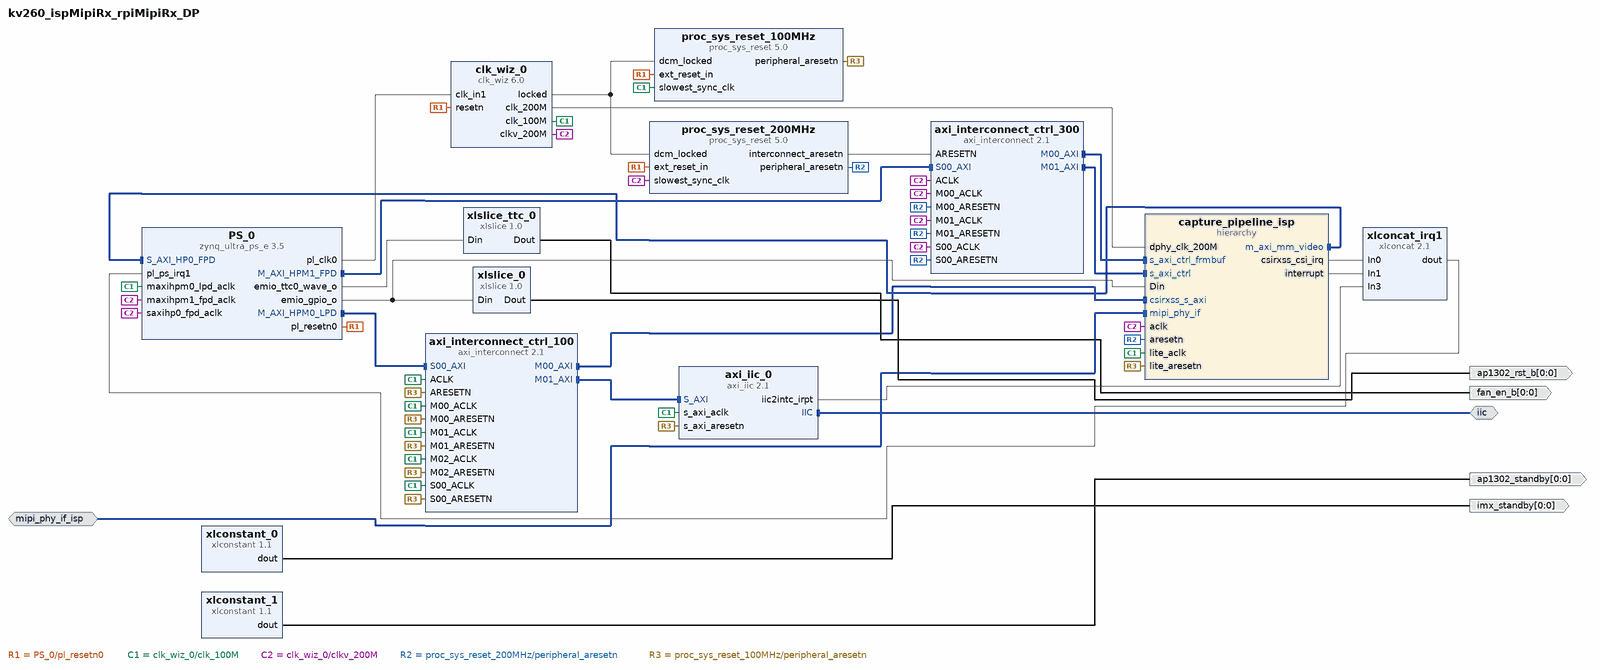
[diagram p0: block diagram of the top level]
# Vivado block design kv260_ispMipiRx_rpiMipiRx_DP, xck26-sfvc784-2LV-c, Vivado 2023.1
create_bd_design kv260_ispMipiRx_rpiMipiRx_DP

create_bd_intf_port -mode Master -vlnv xilinx.com:interface:iic_rtl:1.0 iic
create_bd_intf_port -mode Slave -vlnv xilinx.com:interface:mipi_phy_rtl:1.0 mipi_phy_if_isp
create_bd_port -dir O -from 0 -to 0 ap1302_rst_b
create_bd_port -dir O -from 0 -to 0 ap1302_standby
create_bd_port -dir O -from 0 -to 0 fan_en_b
create_bd_port -dir O -from 0 -to 0 imx_standby

create_bd_cell -type ip -vlnv xilinx.com:ip:zynq_ultra_ps_e:3.5 PS_0
set_property -dict [list \
  CONFIG.PSU_BANK_0_IO_STANDARD LVCMOS18 \
  CONFIG.PSU_BANK_1_IO_STANDARD LVCMOS18 \
  CONFIG.PSU_BANK_2_IO_STANDARD LVCMOS18 \
  CONFIG.PSU_BANK_3_IO_STANDARD LVCMOS18 \
  CONFIG.PSU_USB3__DUAL_CLOCK_ENABLE 1 \
  CONFIG.PSU__CAN1__PERIPHERAL__ENABLE 0 \
  CONFIG.PSU__CRF_APB__ACPU_CTRL__FREQMHZ 1333.333 \
  CONFIG.PSU__CRF_APB__ACPU_CTRL__SRCSEL APLL \
  CONFIG.PSU__CRF_APB__APLL_CTRL__SRCSEL PSS_REF_CLK \
  CONFIG.PSU__CRF_APB__APLL_FRAC_CFG__ENABLED 1 \
  CONFIG.PSU__CRF_APB__DBG_FPD_CTRL__FREQMHZ 250 \
  CONFIG.PSU__CRF_APB__DBG_FPD_CTRL__SRCSEL IOPLL \
  CONFIG.PSU__CRF_APB__DBG_TRACE_CTRL__FREQMHZ 250 \
  CONFIG.PSU__CRF_APB__DBG_TRACE_CTRL__SRCSEL IOPLL \
  CONFIG.PSU__CRF_APB__DBG_TSTMP_CTRL__FREQMHZ 250 \
  CONFIG.PSU__CRF_APB__DBG_TSTMP_CTRL__SRCSEL IOPLL \
  CONFIG.PSU__CRF_APB__DDR_CTRL__FREQMHZ 1200 \
  CONFIG.PSU__CRF_APB__DDR_CTRL__SRCSEL DPLL \
  CONFIG.PSU__CRF_APB__DPDMA_REF_CTRL__FREQMHZ 600 \
  CONFIG.PSU__CRF_APB__DPDMA_REF_CTRL__SRCSEL APLL \
  CONFIG.PSU__CRF_APB__DPLL_CTRL__SRCSEL PSS_REF_CLK \
  CONFIG.PSU__CRF_APB__DP_AUDIO_REF_CTRL__SRCSEL RPLL \
  CONFIG.PSU__CRF_APB__DP_STC_REF_CTRL__SRCSEL RPLL \
  CONFIG.PSU__CRF_APB__DP_VIDEO_REF_CTRL__SRCSEL VPLL \
  CONFIG.PSU__CRF_APB__GDMA_REF_CTRL__FREQMHZ 600 \
  CONFIG.PSU__CRF_APB__GDMA_REF_CTRL__SRCSEL DPLL \
  CONFIG.PSU__CRF_APB__GPU_REF_CTRL__FREQMHZ 600 \
  CONFIG.PSU__CRF_APB__GPU_REF_CTRL__SRCSEL IOPLL \
  CONFIG.PSU__CRF_APB__TOPSW_LSBUS_CTRL__FREQMHZ 100 \
  CONFIG.PSU__CRF_APB__TOPSW_LSBUS_CTRL__SRCSEL IOPLL \
  CONFIG.PSU__CRF_APB__TOPSW_MAIN_CTRL__FREQMHZ 533.33 \
  CONFIG.PSU__CRF_APB__TOPSW_MAIN_CTRL__SRCSEL DPLL \
  CONFIG.PSU__CRF_APB__VPLL_CTRL__SRCSEL PSS_REF_CLK \
  CONFIG.PSU__CRL_APB__ADMA_REF_CTRL__FREQMHZ 500 \
  CONFIG.PSU__CRL_APB__ADMA_REF_CTRL__SRCSEL IOPLL \
  CONFIG.PSU__CRL_APB__CAN1_REF_CTRL__FREQMHZ 100 \
  CONFIG.PSU__CRL_APB__CAN1_REF_CTRL__SRCSEL IOPLL \
  CONFIG.PSU__CRL_APB__CPU_R5_CTRL__FREQMHZ 533.333 \
  CONFIG.PSU__CRL_APB__CPU_R5_CTRL__SRCSEL RPLL \
  CONFIG.PSU__CRL_APB__CSU_PLL_CTRL__FREQMHZ 400 \
  CONFIG.PSU__CRL_APB__CSU_PLL_CTRL__SRCSEL IOPLL \
  CONFIG.PSU__CRL_APB__DBG_LPD_CTRL__FREQMHZ 250 \
  CONFIG.PSU__CRL_APB__DBG_LPD_CTRL__SRCSEL IOPLL \
  CONFIG.PSU__CRL_APB__GEM3_REF_CTRL__FREQMHZ 125 \
  CONFIG.PSU__CRL_APB__GEM3_REF_CTRL__SRCSEL IOPLL \
  CONFIG.PSU__CRL_APB__I2C0_REF_CTRL__FREQMHZ 100 \
  CONFIG.PSU__CRL_APB__I2C0_REF_CTRL__SRCSEL IOPLL \
  CONFIG.PSU__CRL_APB__I2C1_REF_CTRL__FREQMHZ 100 \
  CONFIG.PSU__CRL_APB__I2C1_REF_CTRL__SRCSEL IOPLL \
  CONFIG.PSU__CRL_APB__IOPLL_CTRL__SRCSEL PSS_REF_CLK \
  CONFIG.PSU__CRL_APB__IOU_SWITCH_CTRL__FREQMHZ 250 \
  CONFIG.PSU__CRL_APB__IOU_SWITCH_CTRL__SRCSEL IOPLL \
  CONFIG.PSU__CRL_APB__LPD_LSBUS_CTRL__FREQMHZ 100 \
  CONFIG.PSU__CRL_APB__LPD_LSBUS_CTRL__SRCSEL IOPLL \
  CONFIG.PSU__CRL_APB__LPD_SWITCH_CTRL__FREQMHZ 500 \
  CONFIG.PSU__CRL_APB__LPD_SWITCH_CTRL__SRCSEL IOPLL \
  CONFIG.PSU__CRL_APB__PCAP_CTRL__FREQMHZ 200 \
  CONFIG.PSU__CRL_APB__PCAP_CTRL__SRCSEL IOPLL \
  CONFIG.PSU__CRL_APB__PL0_REF_CTRL__FREQMHZ 100 \
  CONFIG.PSU__CRL_APB__PL0_REF_CTRL__SRCSEL IOPLL \
  CONFIG.PSU__CRL_APB__QSPI_REF_CTRL__FREQMHZ 125 \
  CONFIG.PSU__CRL_APB__QSPI_REF_CTRL__SRCSEL IOPLL \
  CONFIG.PSU__CRL_APB__RPLL_CTRL__SRCSEL PSS_REF_CLK \
  CONFIG.PSU__CRL_APB__SDIO0_REF_CTRL__SRCSEL IOPLL \
  CONFIG.PSU__CRL_APB__SDIO1_REF_CTRL__FREQMHZ 200 \
  CONFIG.PSU__CRL_APB__SDIO1_REF_CTRL__SRCSEL IOPLL \
  CONFIG.PSU__CRL_APB__SPI0_REF_CTRL__SRCSEL IOPLL \
  CONFIG.PSU__CRL_APB__SPI1_REF_CTRL__SRCSEL IOPLL \
  CONFIG.PSU__CRL_APB__TIMESTAMP_REF_CTRL__FREQMHZ 100 \
  CONFIG.PSU__CRL_APB__TIMESTAMP_REF_CTRL__SRCSEL IOPLL \
  CONFIG.PSU__CRL_APB__UART0_REF_CTRL__FREQMHZ 100 \
  CONFIG.PSU__CRL_APB__UART0_REF_CTRL__SRCSEL IOPLL \
  CONFIG.PSU__CRL_APB__UART1_REF_CTRL__FREQMHZ 100 \
  CONFIG.PSU__CRL_APB__UART1_REF_CTRL__SRCSEL IOPLL \
  CONFIG.PSU__CRL_APB__USB0_BUS_REF_CTRL__FREQMHZ 250 \
  CONFIG.PSU__CRL_APB__USB0_BUS_REF_CTRL__SRCSEL IOPLL \
  CONFIG.PSU__CRL_APB__USB3_DUAL_REF_CTRL__FREQMHZ 20 \
  CONFIG.PSU__CRL_APB__USB3_DUAL_REF_CTRL__SRCSEL IOPLL \
  CONFIG.PSU__CRL_APB__USB3__ENABLE 1 \
  CONFIG.PSU__CSUPMU__PERIPHERAL__VALID 1 \
  CONFIG.PSU__DDRC__BUS_WIDTH {64 Bit} \
  CONFIG.PSU__DDRC__COMPONENTS Components \
  CONFIG.PSU__DDRC__DEVICE_CAPACITY {8192 MBits} \
  CONFIG.PSU__DDRC__DRAM_WIDTH {16 Bits} \
  CONFIG.PSU__DDRC__ECC Disabled \
  CONFIG.PSU__DDRC__FREQ_MHZ 1066.50 \
  CONFIG.PSU__DDRC__MEMORY_TYPE {DDR 4} \
  CONFIG.PSU__DDRC__SPEED_BIN DDR4_2400R \
  CONFIG.PSU__DDR_HIGH_ADDRESS_GUI_ENABLE 1 \
  CONFIG.PSU__DDR__INTERFACE__FREQMHZ 600.000 \
  CONFIG.PSU__DISPLAYPORT__LANE0__ENABLE 1 \
  CONFIG.PSU__DISPLAYPORT__LANE0__IO {GT Lane1} \
  CONFIG.PSU__DISPLAYPORT__LANE1__ENABLE 1 \
  CONFIG.PSU__DISPLAYPORT__LANE1__IO {GT Lane0} \
  CONFIG.PSU__DISPLAYPORT__PERIPHERAL__ENABLE 1 \
  CONFIG.PSU__DLL__ISUSED 1 \
  CONFIG.PSU__DPAUX__PERIPHERAL__ENABLE 1 \
  CONFIG.PSU__DPAUX__PERIPHERAL__IO {MIO 27 .. 30} \
  CONFIG.PSU__DP__LANE_SEL {Dual Lower} \
  CONFIG.PSU__DP__REF_CLK_FREQ 27 \
  CONFIG.PSU__DP__REF_CLK_SEL {Ref Clk0} \
  CONFIG.PSU__ENET3__FIFO__ENABLE 0 \
  CONFIG.PSU__ENET3__GRP_MDIO__ENABLE 1 \
  CONFIG.PSU__ENET3__GRP_MDIO__IO {MIO 76 .. 77} \
  CONFIG.PSU__ENET3__PERIPHERAL__ENABLE 1 \
  CONFIG.PSU__ENET3__PERIPHERAL__IO {MIO 64 .. 75} \
  CONFIG.PSU__ENET3__PTP__ENABLE 0 \
  CONFIG.PSU__ENET3__TSU__ENABLE 0 \
  CONFIG.PSU__FPGA_PL0_ENABLE 1 \
  CONFIG.PSU__GEM3_COHERENCY 0 \
  CONFIG.PSU__GEM3_ROUTE_THROUGH_FPD 0 \
  CONFIG.PSU__GEM__TSU__ENABLE 0 \
  CONFIG.PSU__GPIO0_MIO__IO {MIO 0 .. 25} \
  CONFIG.PSU__GPIO0_MIO__PERIPHERAL__ENABLE 1 \
  CONFIG.PSU__GPIO1_MIO__IO {MIO 26 .. 51} \
  CONFIG.PSU__GPIO1_MIO__PERIPHERAL__ENABLE 1 \
  CONFIG.PSU__GPIO_EMIO_WIDTH 95 \
  CONFIG.PSU__GPIO_EMIO__PERIPHERAL__ENABLE 1 \
  CONFIG.PSU__GPIO_EMIO__PERIPHERAL__IO 95 \
  CONFIG.PSU__GT__LINK_SPEED HBR \
  CONFIG.PSU__GT__PRE_EMPH_LVL_4 0 \
  CONFIG.PSU__GT__VLT_SWNG_LVL_4 0 \
  CONFIG.PSU__I2C0__PERIPHERAL__ENABLE 0 \
  CONFIG.PSU__I2C1__PERIPHERAL__ENABLE 1 \
  CONFIG.PSU__I2C1__PERIPHERAL__IO {MIO 24 .. 25} \
  CONFIG.PSU__IOU_SLCR__IOU_TTC_APB_CLK__TTC0_SEL APB \
  CONFIG.PSU__IOU_SLCR__IOU_TTC_APB_CLK__TTC1_SEL APB \
  CONFIG.PSU__IOU_SLCR__IOU_TTC_APB_CLK__TTC2_SEL APB \
  CONFIG.PSU__IOU_SLCR__IOU_TTC_APB_CLK__TTC3_SEL APB \
  CONFIG.PSU__MAXIGP1__DATA_WIDTH 32 \
  CONFIG.PSU__OVERRIDE__BASIC_CLOCK 0 \
  CONFIG.PSU__PMU_COHERENCY 0 \
  CONFIG.PSU__PMU__AIBACK__ENABLE 0 \
  CONFIG.PSU__PMU__EMIO_GPI__ENABLE 0 \
  CONFIG.PSU__PMU__EMIO_GPO__ENABLE 0 \
  CONFIG.PSU__PMU__GPI0__ENABLE 1 \
  CONFIG.PSU__PMU__GPI0__IO {MIO 26} \
  CONFIG.PSU__PMU__GPI1__ENABLE 0 \
  CONFIG.PSU__PMU__GPI2__ENABLE 0 \
  CONFIG.PSU__PMU__GPI3__ENABLE 0 \
  CONFIG.PSU__PMU__GPI4__ENABLE 0 \
  CONFIG.PSU__PMU__GPI5__ENABLE 1 \
  CONFIG.PSU__PMU__GPI5__IO {MIO 31} \
  CONFIG.PSU__PMU__GPO0__ENABLE 1 \
  CONFIG.PSU__PMU__GPO0__IO {MIO 32} \
  CONFIG.PSU__PMU__GPO1__ENABLE 1 \
  CONFIG.PSU__PMU__GPO1__IO {MIO 33} \
  CONFIG.PSU__PMU__GPO2__ENABLE 1 \
  CONFIG.PSU__PMU__GPO2__IO {MIO 34} \
  CONFIG.PSU__PMU__GPO2__POLARITY high \
  CONFIG.PSU__PMU__GPO3__ENABLE 1 \
  CONFIG.PSU__PMU__GPO3__IO {MIO 35} \
  CONFIG.PSU__PMU__GPO3__POLARITY low \
  CONFIG.PSU__PMU__GPO4__ENABLE 0 \
  CONFIG.PSU__PMU__GPO5__ENABLE 0 \
  CONFIG.PSU__PMU__PERIPHERAL__ENABLE 1 \
  CONFIG.PSU__PMU__PLERROR__ENABLE 0 \
  CONFIG.PSU__PRESET_APPLIED 1 \
  CONFIG.PSU__PSS_REF_CLK__FREQMHZ 33.333 \
  CONFIG.PSU__QSPI_COHERENCY 0 \
  CONFIG.PSU__QSPI_ROUTE_THROUGH_FPD 0 \
  CONFIG.PSU__QSPI__GRP_FBCLK__ENABLE 0 \
  CONFIG.PSU__QSPI__PERIPHERAL__DATA_MODE x4 \
  CONFIG.PSU__QSPI__PERIPHERAL__ENABLE 1 \
  CONFIG.PSU__QSPI__PERIPHERAL__IO {MIO 0 .. 5} \
  CONFIG.PSU__QSPI__PERIPHERAL__MODE Single \
  CONFIG.PSU__SATA__LANE1__IO {GT Lane3} \
  CONFIG.PSU__SATA__PERIPHERAL__ENABLE 1 \
  CONFIG.PSU__SATA__REF_CLK_FREQ 125 \
  CONFIG.PSU__SATA__REF_CLK_SEL {Ref Clk2} \
  CONFIG.PSU__SAXIGP2__DATA_WIDTH 64 \
  CONFIG.PSU__SD0__CLK_200_SDR_OTAP_DLY 0x3 \
  CONFIG.PSU__SD0__CLK_50_DDR_ITAP_DLY 0x12 \
  CONFIG.PSU__SD0__CLK_50_DDR_OTAP_DLY 0x6 \
  CONFIG.PSU__SD0__CLK_50_SDR_ITAP_DLY 0x15 \
  CONFIG.PSU__SD0__CLK_50_SDR_OTAP_DLY 0x6 \
  CONFIG.PSU__SD0__DATA_TRANSFER_MODE 8Bit \
  CONFIG.PSU__SD0__GRP_POW__ENABLE 1 \
  CONFIG.PSU__SD0__GRP_POW__IO {MIO 23} \
  CONFIG.PSU__SD0__PERIPHERAL__ENABLE 1 \
  CONFIG.PSU__SD0__PERIPHERAL__IO {MIO 13 .. 22} \
  CONFIG.PSU__SD0__RESET__ENABLE 1 \
  CONFIG.PSU__SD0__SLOT_TYPE eMMC \
  CONFIG.PSU__SD1_COHERENCY 0 \
  CONFIG.PSU__SD1_ROUTE_THROUGH_FPD 0 \
  CONFIG.PSU__SD1__CLK_100_SDR_OTAP_DLY 0x3 \
  CONFIG.PSU__SD1__CLK_200_SDR_OTAP_DLY 0x3 \
  CONFIG.PSU__SD1__CLK_50_DDR_ITAP_DLY 0x3D \
  CONFIG.PSU__SD1__CLK_50_DDR_OTAP_DLY 0x4 \
  CONFIG.PSU__SD1__CLK_50_SDR_ITAP_DLY 0x15 \
  CONFIG.PSU__SD1__CLK_50_SDR_OTAP_DLY 0x5 \
  CONFIG.PSU__SD1__DATA_TRANSFER_MODE 8Bit \
  CONFIG.PSU__SD1__GRP_CD__ENABLE 1 \
  CONFIG.PSU__SD1__GRP_CD__IO {MIO 45} \
  CONFIG.PSU__SD1__GRP_POW__ENABLE 1 \
  CONFIG.PSU__SD1__GRP_POW__IO {MIO 43} \
  CONFIG.PSU__SD1__GRP_WP__ENABLE 0 \
  CONFIG.PSU__SD1__PERIPHERAL__ENABLE 1 \
  CONFIG.PSU__SD1__PERIPHERAL__IO {MIO 39 .. 51} \
  CONFIG.PSU__SD1__SLOT_TYPE {SD 3.0} \
  CONFIG.PSU__SPI1__GRP_SS0__IO {MIO 9} \
  CONFIG.PSU__SPI1__PERIPHERAL__ENABLE 1 \
  CONFIG.PSU__SPI1__PERIPHERAL__IO {MIO 6 .. 11} \
  CONFIG.PSU__SWDT0__CLOCK__ENABLE 0 \
  CONFIG.PSU__SWDT0__PERIPHERAL__ENABLE 1 \
  CONFIG.PSU__SWDT0__RESET__ENABLE 0 \
  CONFIG.PSU__SWDT1__CLOCK__ENABLE 0 \
  CONFIG.PSU__SWDT1__PERIPHERAL__ENABLE 1 \
  CONFIG.PSU__SWDT1__RESET__ENABLE 0 \
  CONFIG.PSU__TSU__BUFG_PORT_PAIR 0 \
  CONFIG.PSU__TTC0__CLOCK__ENABLE 0 \
  CONFIG.PSU__TTC0__PERIPHERAL__ENABLE 1 \
  CONFIG.PSU__TTC0__WAVEOUT__ENABLE 1 \
  CONFIG.PSU__TTC0__WAVEOUT__IO EMIO \
  CONFIG.PSU__TTC1__CLOCK__ENABLE 0 \
  CONFIG.PSU__TTC1__PERIPHERAL__ENABLE 1 \
  CONFIG.PSU__TTC1__WAVEOUT__ENABLE 0 \
  CONFIG.PSU__TTC2__CLOCK__ENABLE 0 \
  CONFIG.PSU__TTC2__PERIPHERAL__ENABLE 1 \
  CONFIG.PSU__TTC2__WAVEOUT__ENABLE 0 \
  CONFIG.PSU__TTC3__CLOCK__ENABLE 0 \
  CONFIG.PSU__TTC3__PERIPHERAL__ENABLE 1 \
  CONFIG.PSU__TTC3__WAVEOUT__ENABLE 0 \
  CONFIG.PSU__UART1__BAUD_RATE 115200 \
  CONFIG.PSU__UART1__MODEM__ENABLE 0 \
  CONFIG.PSU__UART1__PERIPHERAL__ENABLE 1 \
  CONFIG.PSU__UART1__PERIPHERAL__IO {MIO 36 .. 37} \
  CONFIG.PSU__USB0_COHERENCY 0 \
  CONFIG.PSU__USB0__PERIPHERAL__ENABLE 1 \
  CONFIG.PSU__USB0__PERIPHERAL__IO {MIO 52 .. 63} \
  CONFIG.PSU__USB0__REF_CLK_FREQ 26 \
  CONFIG.PSU__USB0__REF_CLK_SEL {Ref Clk1} \
  CONFIG.PSU__USB2_0__EMIO__ENABLE 0 \
  CONFIG.PSU__USB3_0__EMIO__ENABLE 0 \
  CONFIG.PSU__USB3_0__PERIPHERAL__ENABLE 1 \
  CONFIG.PSU__USB3_0__PERIPHERAL__IO {GT Lane2} \
  CONFIG.PSU__USB__RESET__MODE {Boot Pin} \
  CONFIG.PSU__USB__RESET__POLARITY {Active Low} \
  CONFIG.PSU__USE__IRQ0 1 \
  CONFIG.PSU__USE__IRQ1 1 \
  CONFIG.PSU__USE__M_AXI_GP0 0 \
  CONFIG.PSU__USE__M_AXI_GP1 1 \
  CONFIG.PSU__USE__M_AXI_GP2 1 \
  CONFIG.PSU__USE__S_AXI_GP2 1 \
  CONFIG.SUBPRESET1 Custom \
] [get_bd_cells PS_0]
# 258 more settings of PS_0 are not shown: defaults, MIO pin electricals, DDR timing, and values the tool derives
create_bd_cell -type ip -vlnv xilinx.com:ip:axi_iic:2.1 axi_iic_0
set_property -dict {CONFIG.IIC_BOARD_INTERFACE som240_1_connector_hda_iic_switch CONFIG.IIC_FREQ_KHZ 400} [get_bd_cells axi_iic_0]
create_bd_cell -type ip -vlnv xilinx.com:ip:axi_interconnect:2.1 axi_interconnect_ctrl_100
set_property -dict {CONFIG.ENABLE_ADVANCED_OPTIONS 1 CONFIG.NUM_MI 3} [get_bd_cells axi_interconnect_ctrl_100]
create_bd_cell -type ip -vlnv xilinx.com:ip:axi_interconnect:2.1 axi_interconnect_ctrl_300
set_property -dict {CONFIG.NUM_MI 2 CONFIG.NUM_SI 1} [get_bd_cells axi_interconnect_ctrl_300]
create_bd_cell -type hier capture_pipeline_isp
create_bd_cell -type ip -vlnv xilinx.com:ip:clk_wiz:6.0 clk_wiz_0
set_property -dict [list \
  CONFIG.CLKOUT1_JITTER 102.087 \
  CONFIG.CLKOUT1_PHASE_ERROR 87.181 \
  CONFIG.CLKOUT1_REQUESTED_OUT_FREQ 200.000 \
  CONFIG.CLKOUT2_JITTER 115.833 \
  CONFIG.CLKOUT2_PHASE_ERROR 87.181 \
  CONFIG.CLKOUT2_USED true \
  CONFIG.CLKOUT3_JITTER 102.087 \
  CONFIG.CLKOUT3_PHASE_ERROR 87.181 \
  CONFIG.CLKOUT3_REQUESTED_OUT_FREQ 200.000 \
  CONFIG.CLKOUT3_USED true \
  CONFIG.CLKOUT4_JITTER 83.769 \
  CONFIG.CLKOUT4_PHASE_ERROR 87.181 \
  CONFIG.CLKOUT4_REQUESTED_OUT_FREQ 600.000 \
  CONFIG.CLKOUT4_USED false \
  CONFIG.CLKOUT5_JITTER 94.863 \
  CONFIG.CLKOUT5_PHASE_ERROR 87.181 \
  CONFIG.CLKOUT5_REQUESTED_OUT_FREQ 300.000 \
  CONFIG.CLKOUT5_USED false \
  CONFIG.CLK_OUT1_PORT clk_200M \
  CONFIG.CLK_OUT2_PORT clk_100M \
  CONFIG.CLK_OUT3_PORT clkv_200M \
  CONFIG.CLK_OUT4_PORT clk_600M \
  CONFIG.CLK_OUT5_PORT clk_300M \
  CONFIG.MMCM_CLKOUT0_DIVIDE_F 6.000 \
  CONFIG.MMCM_CLKOUT1_DIVIDE 12 \
  CONFIG.MMCM_CLKOUT2_DIVIDE 6 \
  CONFIG.MMCM_CLKOUT3_DIVIDE 1 \
  CONFIG.MMCM_CLKOUT4_DIVIDE 1 \
  CONFIG.MMCM_DIVCLK_DIVIDE 1 \
  CONFIG.NUM_OUT_CLKS 3 \
  CONFIG.PRIM_SOURCE Global_buffer \
  CONFIG.RESET_PORT resetn \
  CONFIG.RESET_TYPE ACTIVE_LOW \
] [get_bd_cells clk_wiz_0]
create_bd_cell -type ip -vlnv xilinx.com:ip:proc_sys_reset:5.0 proc_sys_reset_100MHz
create_bd_cell -type ip -vlnv xilinx.com:ip:proc_sys_reset:5.0 proc_sys_reset_200MHz
create_bd_cell -type ip -vlnv xilinx.com:ip:xlconcat:2.1 xlconcat_irq1
set_property -dict {CONFIG.NUM_PORTS 4} [get_bd_cells xlconcat_irq1]
create_bd_cell -type ip -vlnv xilinx.com:ip:xlconstant:1.1 xlconstant_0
create_bd_cell -type ip -vlnv xilinx.com:ip:xlconstant:1.1 xlconstant_1
set_property -dict {CONFIG.CONST_VAL 0} [get_bd_cells xlconstant_1]
create_bd_cell -type ip -vlnv xilinx.com:ip:xlslice:1.0 xlslice_0
set_property -dict {CONFIG.DIN_FROM 1 CONFIG.DIN_TO 1 CONFIG.DIN_WIDTH 95 CONFIG.DOUT_WIDTH 1} [get_bd_cells xlslice_0]
create_bd_cell -type ip -vlnv xilinx.com:ip:xlslice:1.0 xlslice_ttc_0
set_property -dict {CONFIG.DIN_FROM 2 CONFIG.DIN_TO 2 CONFIG.DIN_WIDTH 3 CONFIG.DOUT_WIDTH 1} [get_bd_cells xlslice_ttc_0]

# ---- hierarchy /capture_pipeline_isp ----
current_bd_instance /capture_pipeline_isp
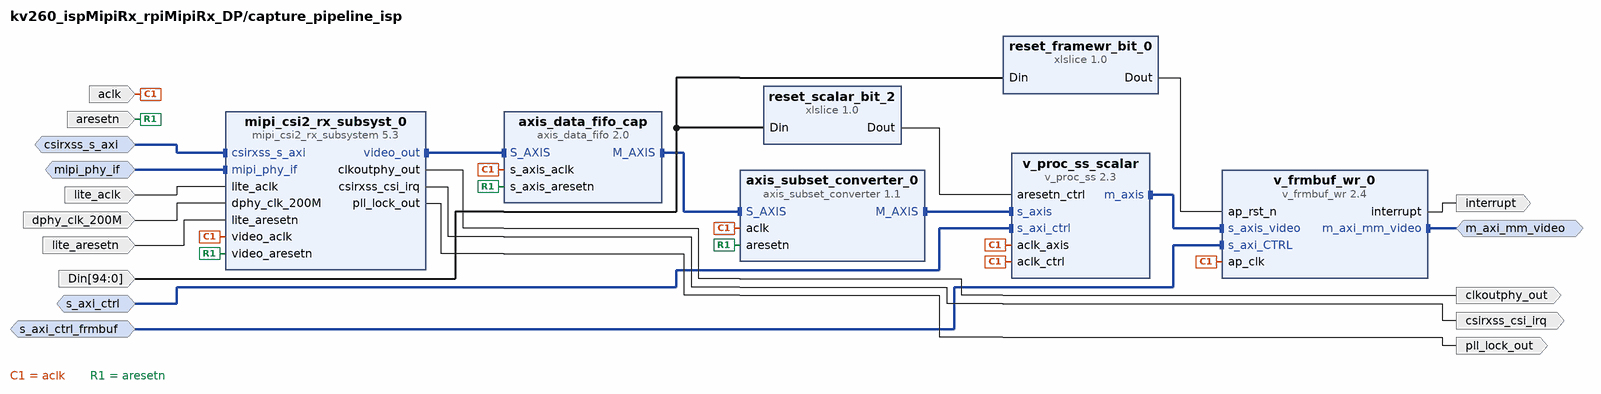
[diagram p1: block diagram inside /capture_pipeline_isp]
create_bd_intf_pin -mode Slave -vlnv xilinx.com:interface:aximm_rtl:1.0 csirxss_s_axi
create_bd_intf_pin -mode Master -vlnv xilinx.com:interface:aximm_rtl:1.0 m_axi_mm_video
create_bd_intf_pin -mode Slave -vlnv xilinx.com:interface:mipi_phy_rtl:1.0 mipi_phy_if
create_bd_intf_pin -mode Slave -vlnv xilinx.com:interface:aximm_rtl:1.0 s_axi_ctrl
create_bd_intf_pin -mode Slave -vlnv xilinx.com:interface:aximm_rtl:1.0 s_axi_ctrl_frmbuf
create_bd_pin -dir I -type clk aclk
create_bd_pin -dir I -type rst aresetn
create_bd_pin -dir O -type clk clkoutphy_out
create_bd_pin -dir O -type intr csirxss_csi_irq
create_bd_pin -dir I -type clk dphy_clk_200M
create_bd_pin -dir O -type intr interrupt
create_bd_pin -dir I -type clk lite_aclk
create_bd_pin -dir I -type rst lite_aresetn
create_bd_pin -dir O pll_lock_out
create_bd_pin -dir I -from 94 -to 0 Din

create_bd_cell -type ip -vlnv xilinx.com:ip:axis_data_fifo:2.0 axis_data_fifo_cap
set_property -dict {CONFIG.FIFO_DEPTH 1024 CONFIG.FIFO_MEMORY_TYPE ultra} [get_bd_cells axis_data_fifo_cap]
create_bd_cell -type ip -vlnv xilinx.com:ip:axis_subset_converter:1.1 axis_subset_converter_0
set_property -dict [list \
  CONFIG.M_TDATA_NUM_BYTES 3 \
  CONFIG.M_TDEST_WIDTH 1 \
  CONFIG.S_TDATA_NUM_BYTES 2 \
  CONFIG.S_TDEST_WIDTH 10 \
  CONFIG.TDATA_REMAP {8'b00000000,tdata[15:0]} \
  CONFIG.TDEST_REMAP {1'b0} \
] [get_bd_cells axis_subset_converter_0]
create_bd_cell -type ip -vlnv xilinx.com:ip:v_frmbuf_wr:2.4 v_frmbuf_wr_0
set_property -dict [list \
  CONFIG.AXIMM_DATA_WIDTH 64 \
  CONFIG.C_M_AXI_MM_VIDEO_DATA_WIDTH 64 \
  CONFIG.HAS_BGR8 1 \
  CONFIG.HAS_BGRX8 0 \
  CONFIG.HAS_RGB8 1 \
  CONFIG.HAS_RGBX8 0 \
  CONFIG.HAS_UYVY8 0 \
  CONFIG.HAS_YUV8 0 \
  CONFIG.HAS_YUYV8 0 \
  CONFIG.HAS_Y_UV8 0 \
  CONFIG.HAS_Y_UV8_420 1 \
  CONFIG.MAX_COLS 1920 \
  CONFIG.MAX_NR_PLANES 2 \
  CONFIG.MAX_ROWS 1080 \
  CONFIG.SAMPLES_PER_CLOCK 1 \
] [get_bd_cells v_frmbuf_wr_0]
create_bd_cell -type ip -vlnv xilinx.com:ip:v_proc_ss:2.3 v_proc_ss_scalar
set_property -dict [list \
  CONFIG.C_COLORSPACE_SUPPORT 0 \
  CONFIG.C_ENABLE_CSC true \
  CONFIG.C_MAX_COLS 1920 \
  CONFIG.C_MAX_DATA_WIDTH 8 \
  CONFIG.C_MAX_ROWS 1080 \
  CONFIG.C_SAMPLES_PER_CLK 1 \
  CONFIG.C_TOPOLOGY 0 \
] [get_bd_cells v_proc_ss_scalar]
create_bd_cell -type ip -vlnv xilinx.com:ip:mipi_csi2_rx_subsystem:5.3 mipi_csi2_rx_subsyst_0
set_property -dict [list \
  CONFIG.CMN_NUM_LANES 4 \
  CONFIG.CMN_PXL_FORMAT YUV422_8bit \
  CONFIG.CMN_VC 0 \
  CONFIG.CSI_BUF_DEPTH 4096 \
  CONFIG.C_CSI_FILTER_USERDATATYPE true \
  CONFIG.C_DPHY_LANES 4 \
  CONFIG.C_HS_LINE_RATE 896 \
  CONFIG.C_HS_SETTLE_NS 146 \
  CONFIG.DPHYRX_BOARD_INTERFACE som240_1_connector_mipi_csi_isp \
  CONFIG.DPY_LINE_RATE 896 \
  CONFIG.SupportLevel 1 \
] [get_bd_cells mipi_csi2_rx_subsyst_0]
create_bd_cell -type ip -vlnv xilinx.com:ip:xlslice:1.0 reset_scalar_bit_2
set_property -dict {CONFIG.DIN_FROM 2 CONFIG.DIN_TO 2 CONFIG.DIN_WIDTH 95} [get_bd_cells reset_scalar_bit_2]
create_bd_cell -type ip -vlnv xilinx.com:ip:xlslice:1.0 reset_framewr_bit_0
set_property -dict {CONFIG.DIN_WIDTH 95} [get_bd_cells reset_framewr_bit_0]

# ---- connections ----

current_bd_instance /capture_pipeline_isp
connect_bd_intf_net [get_bd_intf_pins s_axi_ctrl] [get_bd_intf_pins v_proc_ss_scalar/s_axi_ctrl]
connect_bd_intf_net -intf_net axi_interconnect_0_M11_AXI [get_bd_intf_pins s_axi_ctrl_frmbuf] [get_bd_intf_pins v_frmbuf_wr_0/s_axi_CTRL]
connect_bd_intf_net -intf_net axis_data_fifo_0_M_AXIS [get_bd_intf_pins axis_data_fifo_cap/M_AXIS] [get_bd_intf_pins axis_subset_converter_0/S_AXIS]
connect_bd_intf_net [get_bd_intf_pins axis_subset_converter_0/M_AXIS] [get_bd_intf_pins v_proc_ss_scalar/s_axis]
connect_bd_intf_net [get_bd_intf_pins csirxss_s_axi] [get_bd_intf_pins mipi_csi2_rx_subsyst_0/csirxss_s_axi]
connect_bd_intf_net [get_bd_intf_pins axis_data_fifo_cap/S_AXIS] [get_bd_intf_pins mipi_csi2_rx_subsyst_0/video_out]
connect_bd_intf_net [get_bd_intf_pins mipi_phy_if] [get_bd_intf_pins mipi_csi2_rx_subsyst_0/mipi_phy_if]
connect_bd_intf_net -intf_net v_frmbuf_wr_1_m_axi_mm_video [get_bd_intf_pins m_axi_mm_video] [get_bd_intf_pins v_frmbuf_wr_0/m_axi_mm_video]
connect_bd_intf_net [get_bd_intf_pins v_proc_ss_scalar/m_axis] [get_bd_intf_pins v_frmbuf_wr_0/s_axis_video]
connect_bd_net [get_bd_pins Din] [get_bd_pins reset_scalar_bit_2/Din] [get_bd_pins reset_framewr_bit_0/Din]
connect_bd_net -net clk_wiz_0_clk_100M [get_bd_pins lite_aclk] [get_bd_pins mipi_csi2_rx_subsyst_0/lite_aclk]
connect_bd_net -net clk_wiz_0_clk_200M [get_bd_pins dphy_clk_200M] [get_bd_pins mipi_csi2_rx_subsyst_0/dphy_clk_200M]
connect_bd_net -net clk_wiz_0_clk_300M [get_bd_pins aclk] \
  [get_bd_pins axis_data_fifo_cap/s_axis_aclk] [get_bd_pins axis_subset_converter_0/aclk] [get_bd_pins v_frmbuf_wr_0/ap_clk] \
  [get_bd_pins v_proc_ss_scalar/aclk_axis] [get_bd_pins v_proc_ss_scalar/aclk_ctrl] \
  [get_bd_pins mipi_csi2_rx_subsyst_0/video_aclk]
connect_bd_net [get_bd_pins mipi_csi2_rx_subsyst_0/clkoutphy_out] [get_bd_pins clkoutphy_out]
connect_bd_net [get_bd_pins mipi_csi2_rx_subsyst_0/csirxss_csi_irq] [get_bd_pins csirxss_csi_irq]
connect_bd_net [get_bd_pins mipi_csi2_rx_subsyst_0/pll_lock_out] [get_bd_pins pll_lock_out]
connect_bd_net -net proc_sys_reset_1_peripheral_aresetn [get_bd_pins aresetn] \
  [get_bd_pins axis_data_fifo_cap/s_axis_aresetn] [get_bd_pins axis_subset_converter_0/aresetn] \
  [get_bd_pins mipi_csi2_rx_subsyst_0/video_aresetn]
connect_bd_net -net proc_sys_reset_2_peripheral_aresetn [get_bd_pins lite_aresetn] [get_bd_pins mipi_csi2_rx_subsyst_0/lite_aresetn]
connect_bd_net [get_bd_pins reset_framewr_bit_0/Dout] [get_bd_pins v_frmbuf_wr_0/ap_rst_n]
connect_bd_net [get_bd_pins reset_scalar_bit_2/Dout] [get_bd_pins v_proc_ss_scalar/aresetn_ctrl]
connect_bd_net -net v_frmbuf_wr_1_interrupt [get_bd_pins v_frmbuf_wr_0/interrupt] [get_bd_pins interrupt]

current_bd_instance /
connect_bd_intf_net [get_bd_intf_pins PS_0/M_AXI_HPM1_FPD] [get_bd_intf_pins axi_interconnect_ctrl_300/S00_AXI]
connect_bd_intf_net [get_bd_intf_pins PS_0/M_AXI_HPM0_LPD] [get_bd_intf_pins axi_interconnect_ctrl_100/S00_AXI]
connect_bd_intf_net [get_bd_intf_ports iic] [get_bd_intf_pins axi_iic_0/IIC]
connect_bd_intf_net [get_bd_intf_pins axi_iic_0/S_AXI] [get_bd_intf_pins axi_interconnect_ctrl_100/M01_AXI]
connect_bd_intf_net [get_bd_intf_pins axi_interconnect_ctrl_300/M00_AXI] [get_bd_intf_pins capture_pipeline_isp/s_axi_ctrl_frmbuf]
connect_bd_intf_net [get_bd_intf_pins axi_interconnect_ctrl_300/M01_AXI] [get_bd_intf_pins capture_pipeline_isp/s_axi_ctrl]
connect_bd_intf_net [get_bd_intf_pins PS_0/S_AXI_HP0_FPD] [get_bd_intf_pins capture_pipeline_isp/m_axi_mm_video]
connect_bd_intf_net [get_bd_intf_pins axi_interconnect_ctrl_100/M00_AXI] [get_bd_intf_pins capture_pipeline_isp/csirxss_s_axi]
connect_bd_intf_net [get_bd_intf_ports mipi_phy_if_isp] [get_bd_intf_pins capture_pipeline_isp/mipi_phy_if]
connect_bd_net [get_bd_pins PS_0/emio_gpio_o] [get_bd_pins xlslice_0/Din] [get_bd_pins capture_pipeline_isp/Din]
connect_bd_net [get_bd_pins PS_0/pl_clk0] [get_bd_pins clk_wiz_0/clk_in1]
connect_bd_net [get_bd_pins PS_0/pl_resetn0] \
  [get_bd_pins clk_wiz_0/resetn] [get_bd_pins proc_sys_reset_100MHz/ext_reset_in] \
  [get_bd_pins proc_sys_reset_200MHz/ext_reset_in]
connect_bd_net [get_bd_pins axi_iic_0/iic2intc_irpt] [get_bd_pins xlconcat_irq1/In3]
connect_bd_net [get_bd_pins capture_pipeline_isp/csirxss_csi_irq] [get_bd_pins xlconcat_irq1/In0]
connect_bd_net [get_bd_pins capture_pipeline_isp/interrupt] [get_bd_pins xlconcat_irq1/In1]
connect_bd_net [get_bd_pins clk_wiz_0/clk_100M] \
  [get_bd_pins PS_0/maxihpm0_lpd_aclk] [get_bd_pins axi_iic_0/s_axi_aclk] [get_bd_pins axi_interconnect_ctrl_100/ACLK] \
  [get_bd_pins axi_interconnect_ctrl_100/M00_ACLK] [get_bd_pins axi_interconnect_ctrl_100/M01_ACLK] \
  [get_bd_pins axi_interconnect_ctrl_100/M02_ACLK] [get_bd_pins axi_interconnect_ctrl_100/S00_ACLK] \
  [get_bd_pins capture_pipeline_isp/lite_aclk] [get_bd_pins proc_sys_reset_100MHz/slowest_sync_clk]
connect_bd_net [get_bd_pins clk_wiz_0/clk_200M] [get_bd_pins capture_pipeline_isp/dphy_clk_200M]
connect_bd_net -net clk_wiz_0_clk_300M [get_bd_pins clk_wiz_0/clkv_200M] \
  [get_bd_pins PS_0/maxihpm1_fpd_aclk] [get_bd_pins PS_0/saxihp0_fpd_aclk] [get_bd_pins axi_interconnect_ctrl_300/ACLK] \
  [get_bd_pins axi_interconnect_ctrl_300/M00_ACLK] [get_bd_pins axi_interconnect_ctrl_300/M01_ACLK] \
  [get_bd_pins axi_interconnect_ctrl_300/S00_ACLK] [get_bd_pins capture_pipeline_isp/aclk] \
  [get_bd_pins proc_sys_reset_200MHz/slowest_sync_clk]
connect_bd_net [get_bd_pins clk_wiz_0/locked] [get_bd_pins proc_sys_reset_100MHz/dcm_locked] [get_bd_pins proc_sys_reset_200MHz/dcm_locked]
connect_bd_net -net proc_sys_reset_1_interconnect_aresetn [get_bd_pins proc_sys_reset_200MHz/interconnect_aresetn] \
  [get_bd_pins axi_interconnect_ctrl_300/ARESETN]
connect_bd_net -net proc_sys_reset_1_peripheral_aresetn [get_bd_pins proc_sys_reset_200MHz/peripheral_aresetn] \
  [get_bd_pins axi_interconnect_ctrl_300/M00_ARESETN] [get_bd_pins axi_interconnect_ctrl_300/M01_ARESETN] \
  [get_bd_pins axi_interconnect_ctrl_300/S00_ARESETN] [get_bd_pins capture_pipeline_isp/aresetn]
connect_bd_net -net proc_sys_reset_2_peripheral_aresetn [get_bd_pins proc_sys_reset_100MHz/peripheral_aresetn] \
  [get_bd_pins axi_iic_0/s_axi_aresetn] [get_bd_pins axi_interconnect_ctrl_100/ARESETN] \
  [get_bd_pins axi_interconnect_ctrl_100/M00_ARESETN] [get_bd_pins axi_interconnect_ctrl_100/M01_ARESETN] \
  [get_bd_pins axi_interconnect_ctrl_100/M02_ARESETN] [get_bd_pins axi_interconnect_ctrl_100/S00_ARESETN] \
  [get_bd_pins capture_pipeline_isp/lite_aresetn]
connect_bd_net -net xlconcat_0_0_dout [get_bd_pins xlconcat_irq1/dout] [get_bd_pins PS_0/pl_ps_irq1]
connect_bd_net [get_bd_pins xlconstant_0/dout] [get_bd_ports imx_standby]
connect_bd_net [get_bd_pins xlconstant_1/dout] [get_bd_ports ap1302_standby]
connect_bd_net [get_bd_pins xlslice_0/Dout] [get_bd_ports ap1302_rst_b]
connect_bd_net [get_bd_pins xlslice_ttc_0/Dout] [get_bd_ports fan_en_b]
connect_bd_net -net zynq_ultra_ps_e_0_emio_ttc0_wave_o [get_bd_pins PS_0/emio_ttc0_wave_o] [get_bd_pins xlslice_ttc_0/Din]
set_property PFM.AXI_PORT {M_AXI_HPM0_FPD { memport "M_AXI_GP" sptag "" memory "" is_range "false" } S_AXI_HP1_FPD { memport "S_AXI_HP" sptag "HP1" memory "PS_0 HP1_DDR_LOW" is_range "false" } S_AXI_HP3_FPD { memport "S_AXI_HP" sptag "HP3" memory "PS_0 HP3_DDR_LOW" is_range "false" } S_AXI_HPC1_FPD { memport "S_AXI_HPC" sptag "HPC1" memory "PS_0 HPC1_DDR_LOW" is_range "false" } } [get_bd_cells PS_0]
set_property PFM.IRQ {pl_ps_irq0 {id 0 range 7}} [get_bd_cells PS_0]
set_property PFM.CLOCK {clk_100M {id "2" is_default "false" proc_sys_reset "/proc_sys_reset_100MHz" status "fixed" freq_hz "99999000"} clk_600M {id "1" is_default "false" proc_sys_reset "" status "fixed" freq_hz "599994000"} clk_300M {id "0" is_default "true" proc_sys_reset "" status "fixed" freq_hz "299997000"}} [get_bd_cells clk_wiz_0]

# ---- address map ----
assign_bd_address -offset 0x00000000 -range 2G -target_address_space [get_bd_addr_spaces capture_pipeline_isp/v_frmbuf_wr_0/Data_m_axi_mm_video] [get_bd_addr_segs PS_0/SAXIGP2/HP0_DDR_LOW]
assign_bd_address -offset 0xC0000000 -range 512M -target_address_space [get_bd_addr_spaces capture_pipeline_isp/v_frmbuf_wr_0/Data_m_axi_mm_video] [get_bd_addr_segs PS_0/SAXIGP2/HP0_QSPI]
exclude_bd_addr_seg -offset 0x00000000 -range 1 -target_address_space [get_bd_addr_spaces capture_pipeline_isp/v_frmbuf_wr_0/Data_m_axi_mm_video] [get_bd_addr_segs PS_0/SAXIGP2/HP0_DDR_HIGH]
exclude_bd_addr_seg -offset 0xFF000000 -range 16M -target_address_space [get_bd_addr_spaces capture_pipeline_isp/v_frmbuf_wr_0/Data_m_axi_mm_video] [get_bd_addr_segs PS_0/SAXIGP2/HP0_LPS_OCM]
assign_bd_address -offset 0x0080000000 -range 4K -target_address_space [get_bd_addr_spaces PS_0/Data] [get_bd_addr_segs capture_pipeline_isp/mipi_csi2_rx_subsyst_0/csirxss_s_axi/Reg]
assign_bd_address -offset 0x0080010000 -range 64K -target_address_space [get_bd_addr_spaces PS_0/Data] [get_bd_addr_segs axi_iic_0/S_AXI/Reg]
assign_bd_address -offset 0x00B0000000 -range 64K -target_address_space [get_bd_addr_spaces PS_0/Data] [get_bd_addr_segs capture_pipeline_isp/v_frmbuf_wr_0/s_axi_CTRL/Reg]
assign_bd_address -offset 0x00B0040000 -range 256K -target_address_space [get_bd_addr_spaces PS_0/Data] [get_bd_addr_segs capture_pipeline_isp/v_proc_ss_scalar/s_axi_ctrl/Reg]

validate_bd_design
save_bd_design
